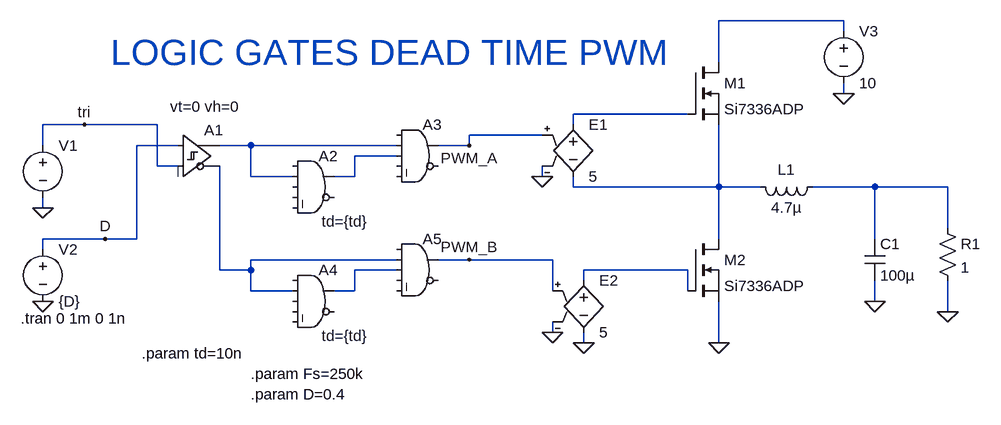
[diagram p0: schematic LogicGateDeadTimePWM.asc]
LogicGateDeadTimePWM.asc, the LTspice schematic file:
Version 4
SHEET 1 1592 1064
WIRE 1184 -48 992 -48
WIRE 1184 -32 1184 -48
WIRE 992 16 992 -48
WIRE 1184 64 1184 48
WIRE 944 96 768 96
WIRE 16 112 -48 112
WIRE 128 112 16 112
WIRE 768 112 768 96
WIRE 720 128 608 128
WIRE -48 144 -48 112
WIRE 160 144 96 144
WIRE 272 144 224 144
WIRE 496 144 272 144
WIRE 608 144 608 128
WIRE 608 144 560 144
WIRE 496 160 432 160
WIRE 128 176 128 112
WIRE 160 176 128 176
WIRE 272 192 272 144
WIRE 336 192 272 192
WIRE 432 192 432 160
WIRE 432 192 400 192
WIRE 720 192 720 176
WIRE 768 208 768 192
WIRE 992 208 992 112
WIRE 992 208 768 208
WIRE 1056 208 992 208
WIRE 1232 208 1136 208
WIRE 1344 208 1232 208
WIRE -48 240 -48 224
WIRE 1344 272 1344 208
WIRE 48 288 -48 288
WIRE 96 288 96 144
WIRE 96 288 48 288
WIRE 992 288 992 208
WIRE 1232 288 1232 208
WIRE -48 304 -48 288
WIRE 496 320 272 320
WIRE 608 320 560 320
WIRE 736 320 608 320
WIRE 224 336 224 176
WIRE 272 336 272 320
WIRE 272 336 224 336
WIRE 496 336 432 336
WIRE 944 336 784 336
WIRE 784 352 784 336
WIRE 272 368 272 336
WIRE 336 368 272 368
WIRE 432 368 432 336
WIRE 432 368 400 368
WIRE 736 368 736 320
WIRE 944 368 944 336
WIRE 1232 384 1232 352
WIRE 1344 400 1344 352
WIRE 736 432 736 416
WIRE 784 448 784 432
WIRE 992 448 992 384
FLAG -48 240 0
FLAG 16 112 tri
FLAG -48 384 0
FLAG 48 288 D
FLAG 608 144 PWM_A
FLAG 608 320 PWM_B
FLAG 992 448 0
FLAG 1232 384 0
FLAG 1344 400 0
FLAG 1184 64 0
FLAG 720 192 0
FLAG 736 432 0
FLAG 784 448 0
SYMBOL voltage -48 128 R0
WINDOW 3 24 96 Invisible 2
WINDOW 123 0 0 Left 0
WINDOW 39 0 0 Left 0
SYMATTR InstName V1
SYMATTR Value PULSE(0 1 0 {1/(2*Fs)} {1/(2*Fs)} 1n {1/(Fs)})
SYMBOL voltage -48 288 R0
SYMATTR InstName V2
SYMATTR Value {D}
SYMBOL Digital\\diffschmitt 160 96 R0
WINDOW 3 -12 -12 Left 2
SYMATTR InstName A1
SYMATTR Value vt=0 vh=0
SYMBOL Digital\\and 368 144 R0
WINDOW 3 13 117 Left 2
SYMATTR InstName A2
SYMATTR Value td={td}
SYMBOL Digital\\and 528 96 R0
SYMATTR InstName A3
SYMBOL Digital\\and 368 320 R0
WINDOW 3 13 117 Left 2
SYMATTR InstName A4
SYMATTR Value td={td}
SYMBOL Digital\\and 528 272 R0
SYMATTR InstName A5
SYMBOL nmos 944 16 R0
SYMATTR InstName M1
SYMATTR Value Si7336ADP
SYMBOL nmos 944 288 R0
SYMATTR InstName M2
SYMATTR Value Si7336ADP
SYMBOL ind 1152 192 R90
WINDOW 0 5 56 VBottom 2
WINDOW 3 32 56 VTop 2
SYMATTR InstName L1
SYMATTR Value 4.7µ
SYMBOL cap 1216 288 R0
SYMATTR InstName C1
SYMATTR Value 100µ
SYMBOL res 1328 256 R0
SYMATTR InstName R1
SYMATTR Value 1
SYMBOL voltage 1184 -48 R0
SYMATTR InstName V3
SYMATTR Value 10
SYMBOL e 768 96 R0
SYMATTR InstName E1
SYMATTR Value 5
SYMBOL e 784 336 R0
SYMATTR InstName E2
SYMATTR Value 5
TEXT 272 496 Left 2 !.param Fs=250k\n.param D=0.4
TEXT 104 464 Left 2 !.param td=10n
TEXT -82 410 Left 2 !.tran 0 1m 0 1n
TEXT 56 0 Left 5 ;LOGIC GATES DEAD TIME PWM

The netlist it stands for:
* LogicGateDeadTimePWM.asc
V1 tri 0 PULSE(0 1 0 {1/(2*Fs)} {1/(2*Fs)} 1n {1/(Fs)})
V2 D 0 {D}
A1 D tri 0 0 0 N007 N003 0 SCHMITT vt=0 vh=0
A2 0 N003 0 0 0 0 N004 0 AND td={td}
A3 0 N003 N004 0 0 0 PWM_A 0 AND
A4 0 N007 0 0 0 0 N008 0 AND td={td}
A5 0 N007 N008 0 0 0 PWM_B 0 AND
M1 N001 N002 N005 N005 Si7336ADP
M2 N005 N009 0 0 Si7336ADP
L1 N006 N005 4.7µ
C1 N006 0 100µ
R1 N006 0 1
V3 N001 0 10
E1 N002 N005 PWM_A 0 5
E2 N009 0 PWM_B 0 5
.model NMOS NMOS
.model PMOS PMOS
.lib standard.mos
.param Fs=250k
.param D=0.4
.param td=10n
.tran 0 1m 0 1n
* LOGIC GATES DEAD TIME PWM
.backanno
.end